# Altium schematic sheet Sheet1.SchDoc
size 420 x 297 mm; Address1: Address1; Address2: Address2; Address3: Address3; Address4: Address4; DocumentNumber: АБВГ.123456.001 Э3; SheetNumber: 1; Scale: 1:1; DocumentType: Схема электрическая принципиальная; FirstReferrence: АБВГ.123456.001
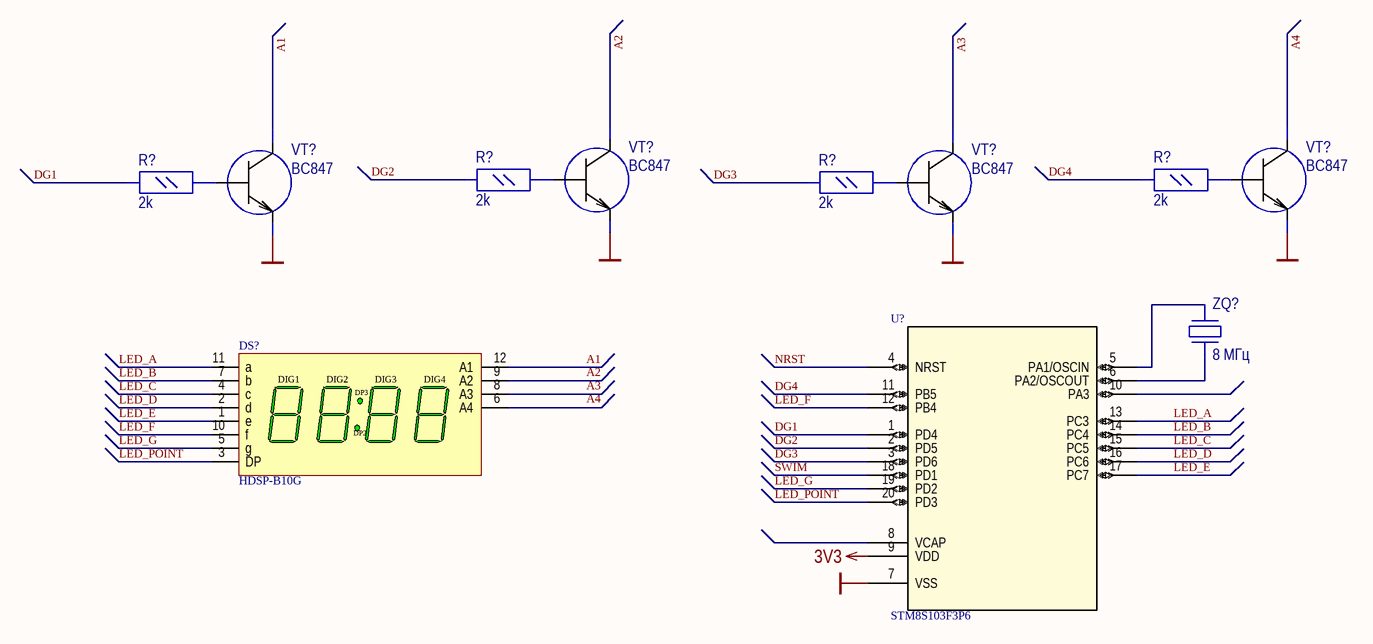
[diagram p0: Sheet1.SchDoc]

## Parts
(Parts that share a designator on the sheet are numbered #1, #2 ... from top to bottom, then left to right.)
DS?  HDSP-B10G  [B-88]
R?#1  2k  [R_0805]
R?#2  2k  [R_0805]
R?#3  2k  [R_0805]
R?#4  2k  [R_0805]
U?  STM8S103F3P6  [TSSOP20]
VT?#1  BC847  [SOT23]
VT?#2  BC847  [SOT23]
VT?#3  BC847  [SOT23]
VT?#4  BC847  [SOT23]
ZQ?  8 МГц  [MJ CRYSTAL]

## Nets
3V3: U?.9(VDD)
GND: U?.7(VSS) VT?#1.2(E) VT?#2.2(E) VT?#3.2(E) VT?#4.2(E)
A1: DS?.12(A1) VT?#1.3(C)
A2: DS?.9(A2) VT?#2.3(C)
A3: DS?.8(A3) VT?#3.3(C)
A4: VT?#4.3(C)
DG1: R?#1.1 U?.1(PD4)
DG2: R?#2.1 U?.2(PD5)
DG3: R?#3.1 U?.3(PD6)
DG4: R?#4.1 U?.11(PB5)
LED_A: DS?.11(a) U?.13(PC3)
LED_B: DS?.7(b) U?.14(PC4)
LED_C: DS?.4(c) U?.15(PC5)
LED_D: DS?.2(d) U?.16(PC6)
LED_E: DS?.1(e) U?.17(PC7)
LED_F: DS?.10(f) U?.12(PB4)
LED_G: DS?.5(g) U?.19(PD2)
LED_POINT: DS?.3(DP) U?.20(PD3)
NRST: U?.4(NRST)
SWIM: U?.18(PD1)
NetR?#1_2: R?#1.2 VT?#1.1(B)
NetR?#2_2: R?#2.2 VT?#2.1(B)
NetR?#3_2: R?#3.2 VT?#3.1(B)
NetR?#4_2: R?#4.2 VT?#4.1(B)
NetU?_5: U?.5(PA1/OSCIN) ZQ?.3
NetU?_6: U?.6(PA2/OSCOUT) ZQ?.1

Not connected (* = marked no-connect by the designer): DS? 6(A4); U? 8(VCAP) 10(PA3)

## Notes on the sheet
- Labels drawn without touching a wire or pin: A4
- Перв. примен.
- Справ. №
- Подп. и дата
- Инв. № дубл.
- Взам. инв. №
- Разраб.
- Изм.
- Лист
- № докум.
- Подп.
- Дата
- Лит.
- Масса
- Масштаб
- Пров.
- Т.контр.
- Листов
- Инв. № подл.
- Утв.
- Н.контр.
- 2.106-A3
- Копировал
- Формат А3
- (in symbol HDSP-B10G) DIG1; DIG2; DIG3; DIG4; DP3; DP2

## Library data of the parts
DS? = HDSP-B10G: 14.22 mm Untinted, 88:88 4-Digit 7-Segment Display: CA, Black Surface; LuminousIntensity: 3200 ucd (Minimum).; LED_Colour: Green; Published: 26-May-2004; LatestRevisionDate: 11-Oct-2004; LatestRevisionNote: Display outline superimposed on PCB Footprint.; DatasheetVersion: 23-Sep-2002; PackageVersion: 21-Aug-2001; PackageReference: B-88; Publisher: Altium Limited; PackageDescription: LED, 7-Segment Display, 14.22 mm, Four Digit, 88:88; 12 Leads; Row Space 15.24 mm; Pitch 2.54 mm; ComponentLink1Description: Manufacturer Link; ComponentLink1URL: http://www.agilent.com/; ComponentLink2Description: Datasheet; ComponentLink2URL: http://cp.literature.agilent.com/litweb/pdf/5988-7859EN.pdf
R?#1-R?#4 = R_0805
U? = STM8S103F3P6: No Description Available; SourceLibrary: Updates_to_database_2020-10-19; Built_By: EMA_UL_Team; Vendor: STMicroelectronics; Copyright: Copyright (C) 2018 Accelerated Designs. All rights reserved; Manufacturer_Part_Number: STM8S103F3P6; RefDes: RefDes; Type: DEV
ZQ? = NX5032GA-8MHz